# Altium schematic sheet control3_MCU.SchDoc
size A3; SheetNumber: 1; SheetTotal: 1
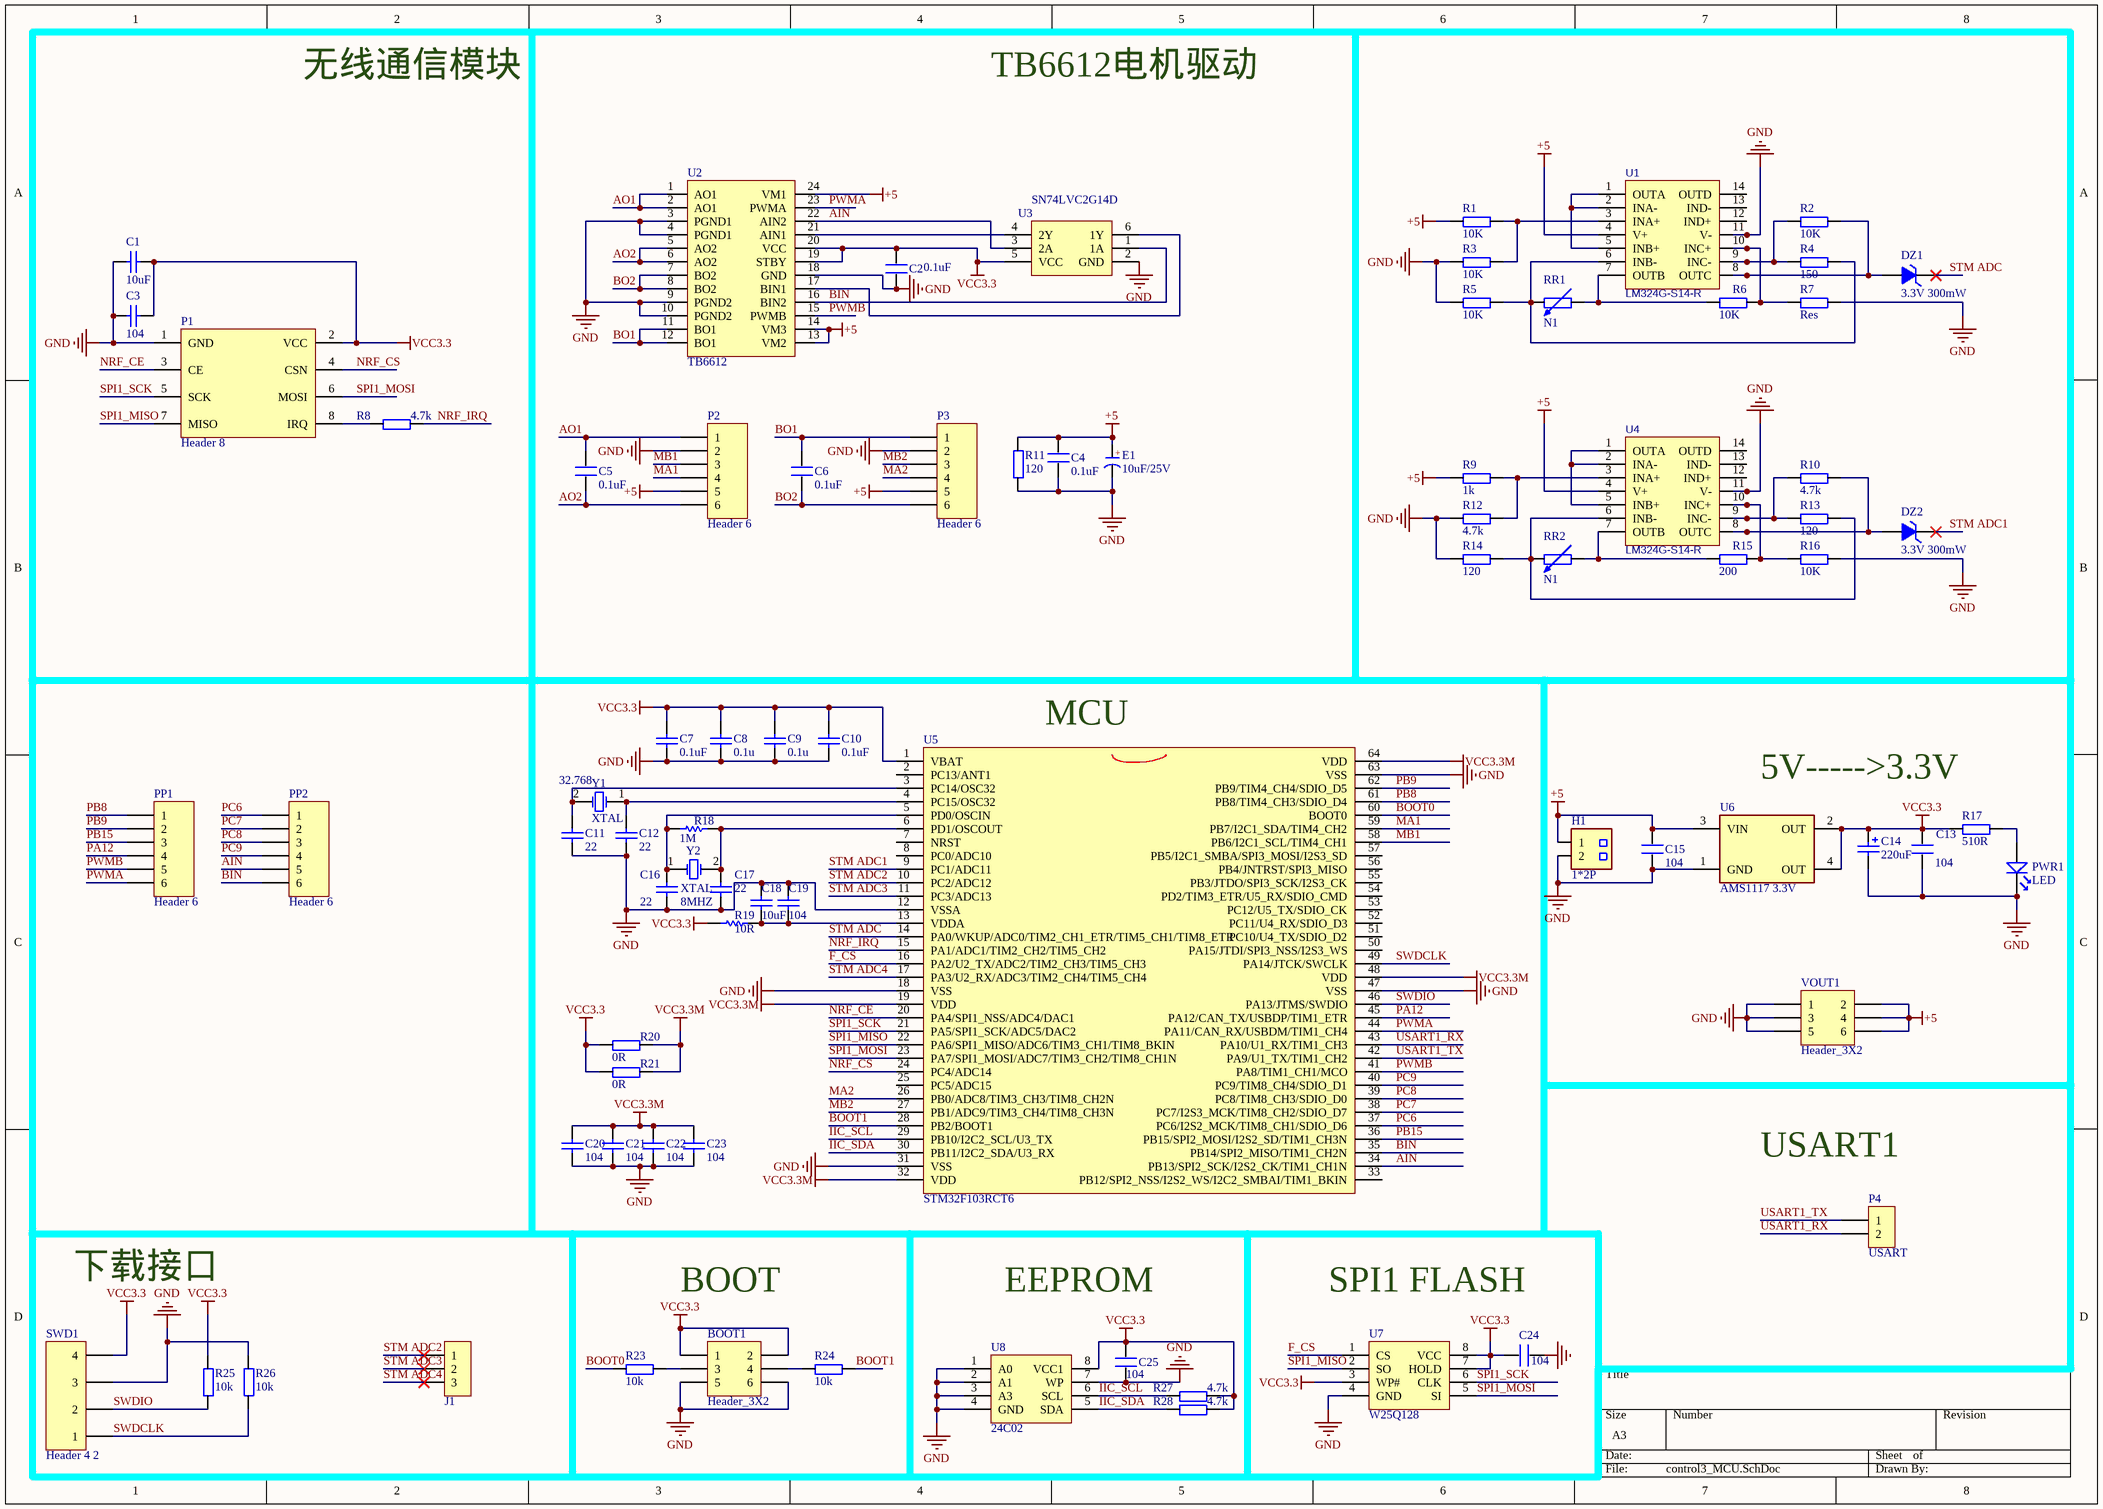
[diagram p0: control3_MCU.SchDoc]

## Parts
BOOT1  Header_3X2  [H2.54-2X3]
C1  Cap  [CAP[0603]]  (value not drawn)
C2  0.1uF  [CAP[0603]]
C3  Cap  [CAP[0603]]  (value not drawn)
C4  0.1uF  [CAP[0603]]
C5  0.1uF  [CAP[0603]]
C6  0.1uF  [CAP[0603]]
C7  0.1uF  [CAP[0603]]
C8  104  [CAP[0603]]  (value not drawn)
C9  104  [CAP[0603]]  (value not drawn)
C10  0.1uF  [CAP[0603]]
C11  Cap  [CAP[0603]]  (value not drawn)
C12  Cap  [CAP[0603]]  (value not drawn)
C13  104  [CAP[0805]]
C14  220uF  [CAP-D8SMD]
C15  104  [CAP[0805]]
C16  Cap  [CAP[0805]]  (value not drawn)
C17  Cap  [CAP[0805]]  (value not drawn)
C18  Cap  [CAP[0805]]  (value not drawn)
C19  Cap  [CAP[0805]]  (value not drawn)
C20  Cap  [CAP[0603]]  (value not drawn)
C21  Cap  [CAP[0603]]  (value not drawn)
C22  Cap  [CAP[0603]]  (value not drawn)
C23  Cap  [CAP[0603]]  (value not drawn)
C24  104  [CAP[0603]]
C25  104  [CAP[0603]]
DZ1  3.3V 300mW  [SOD-123_L2.8-W1.8-LS3.7-RD]
DZ2  3.3V 300mW  [SOD-123_L2.8-W1.8-LS3.7-RD]
E1  10uF/25V  [CAP-SMD_L3.5-W2.8-R-RD]
H1  1*2P  [CONN-TH_P2.54_KF128-2.54-2P]
J1  HDR-1X3  [H2.54-1X3]  (value not drawn)
P1  Header 8  [HDR2.54-LI-2x4P]
P2  Header 6  [CONN-TH_6P-P2.54_KF128-2.54-6P]
P3  Header 6  [CONN-TH_6P-P2.54_KF128-2.54-6P]
P4  USART  [H2.54-1X2]
PP1  Header 6  [HDR2.54-LI-6P]
PP2  Header 6  [HDR2.54-LI-6P]
PWR1  LED  [LED[0805]]
R1  10K  [0603_R_JX]
R2  10K  [0603_R_JX]
R3  10K  [0603_R_JX]
R4  150  [0603_R_JX]
R5  10K  [0603_R_JX]
R6  10K  [0603_R_JX]
R7  Res  [RES[0603]]
R8  4.7k  [RES[0603]]
R9  1k  [0603_R_JX]
R10  4.7k  [RES[0603]]
R11  120  [RES[0603]]
R12  4.7k  [RES[0603]]
R13  120  [RES[0603]]
R14  120  [RES[0603]]
R15  200  [0603_R_JX]
R16  10K  [0603_R_JX]
R17  510R  [RES[0603]]
R18  Res  [RES[0603]]  (value not drawn)
R19  Res  [RES[0603]]  (value not drawn)
R20  0R  [RES[0603]]
R21  0R  [RES[0603]]
R23  10k  [RES[0603]]
R24  10k  [RES[0603]]
R25  10k  [RES[0603]]
R26  10k  [RES[0603]]
R27  4.7k  [RES[0603]]
R28  4.7k  [RES[0603]]
RR1  N1  [CONN-TH_P2.54_KF128-2.54-2P]
RR2  N1  [CONN-TH_P2.54_KF128-2.54-2P]
SWD1  Header 4 2  [H2.54-1X4]
U1  LM324G-S14-R  [LM324]
U2  TB6612  [SSOP24_L]
U3  SN74LVC2G14D  [SOT23-6L]
U4  LM324G-S14-R  [LM324]
U5  STM32F103RCT6  [LQFP-64]
U6  AMS1117 3.3V  [SOT-223(AMS1117-3.3)]
U7  W25Q128  [SOP-8_width]
U8  24C02  [SO-8]
VOUT1  Header_3X2  [H2.54-2X3]
Y1  XTAL  [XTAL-32768_2]
Y2  XTAL  [XTAL]

## Nets
+5: C4.2 C15.2 E1.1(A) H1.1 P2.5 P3.5 R1.1 R9.1 R11.2 U1.4(V+) U2.13(VM2) U2.14(VM3) U2.24(VM1) U4.4(V+) U6.3(VIN) VOUT1.2 VOUT1.4 VOUT1.6
GND: BOOT1.5 BOOT1.6 C1.2 C2.1 C3.2 C4.1 C7.1 C8.1 C9.1 C10.1 C11.1 C12.1 C13.1 C14.2 C15.1 C16.1 C17.1 C18.2 C19.2 C20.2 C21.2 C22.2 C23.2 C24.1 C25.1 E1.2(K) H1.2 P1.1(GND) P2.2 P3.2 PWR1.2 R3.1 R5.1 R7.2 R11.1 R12.1 R14.1 R16.1 R26.2 SWD1.3 U1.11(V-) U2.3(PGND1) U2.4(PGND1) U2.9(PGND2) U2.10(PGND2) U2.18(GND) U3.2(GND) U4.11(V-) U5.12(VSSA) U5.18(VSS) U5.31(VSS) U5.47(VSS) U5.63(VSS) U6.1(GND) U7.4(GND) U8.1(A0) U8.2(A1) U8.3(A3) U8.4(GND) U8.7(WP) VOUT1.1 VOUT1.3 VOUT1.5
VCC3.3: BOOT1.1 BOOT1.2 C1.1 C2.2 C3.1 C7.2 C8.2 C9.2 C10.2 C13.2 C14.1 C24.2 C25.2 P1.2(VCC) R17.1 R19.2 R20.1 R21.1 R25.2 R27.2 R28.2 SWD1.4 U2.19(STBY) U2.20(VCC) U3.5(VCC) U5.1(VBAT) U6.2(OUT) U6.4(OUT) U7.3(WP#) U7.7(HOLD) U7.8(VCC) U8.8(VCC1)
VCC3.3M: C20.1 C21.1 C22.1 C23.1 R20.2 R21.2 U5.19(VDD) U5.32(VDD) U5.48(VDD) U5.64(VDD)
AIN: PP2.5 U2.22(AIN2) U3.3(2A) U5.34(PB13/SPI2_SCK/I2S2_CK/TIM1_CH1N)
AO1: C5.2 P2.1 U2.1(AO1) U2.2(AO1)
AO2: C5.1 P2.6 U2.5(AO2) U2.6(AO2)
BIN: PP2.6 U2.16(BIN2) U3.1(1A) U5.35(PB14/SPI2_MISO/TIM1_CH2N)
BO1: C6.2 P3.1 U2.11(BO1) U2.12(BO1)
BO2: C6.1 P3.6 U2.7(BO2) U2.8(BO2)
BOOT0: R23.1 U5.60(BOOT0)
BOOT1: R24.2 U5.28(PB2/BOOT1)
F_CS: U5.16(PA2/U2_TX/ADC2/TIM2_CH3/TIM5_CH3) U7.1(CS)
IIC_SCL: R27.1 U5.29(PB10/I2C2_SCL/U3_TX) U8.6(SCL)
IIC_SDA: R28.1 U5.30(PB11/I2C2_SDA/U3_RX) U8.5(SDA)
MA1: P2.4 U5.59(PB7/I2C1_SDA/TIM4_CH2)
MA2: P3.4 U5.26(PB0/ADC8/TIM3_CH3/TIM8_CH2N)
MB1: P2.3 U5.58(PB6/I2C1_SCL/TIM4_CH1)
MB2: P3.3 U5.27(PB1/ADC9/TIM3_CH4/TIM8_CH3N)
NRF_CE: P1.3(CE) U5.20(PA4/SPI1_NSS/ADC4/DAC1)
NRF_CS: P1.4(CSN) U5.24(PC4/ADC14)
NRF_IRQ: R8.2 U5.15(PA1/ADC1/TIM2_CH2/TIM5_CH2)
PA12: PP1.4 U5.45(PA12/CAN_TX/USBDP/TIM1_ETR)
PB8: PP1.1 U5.61(PB8/TIM4_CH3/SDIO_D4)
PB9: PP1.2 U5.62(PB9/TIM4_CH4/SDIO_D5)
PB15: PP1.3 U5.36(PB15/SPI2_MOSI/I2S2_SD/TIM1_CH3N)
PC6: PP2.1 U5.37(PC6/I2S2_MCK/TIM8_CH1/SDIO_D6)
PC7: PP2.2 U5.38(PC7/I2S3_MCK/TIM8_CH2/SDIO_D7)
PC8: PP2.3 U5.39(PC8/TIM8_CH3/SDIO_D0)
PC9: PP2.4 U5.40(PC9/TIM8_CH4/SDIO_D1)
PWMA: PP1.6 U2.23(PWMA) U5.44(PA11/CAN_RX/USBDM/TIM1_CH4)
PWMB: PP1.5 U2.15(PWMB) U5.41(PA8/TIM1_CH1/MCO)
SPI1_MISO: P1.7(MISO) U5.22(PA6/SPI1_MISO/ADC6/TIM3_CH1/TIM8_BKIN) U7.2(SO)
SPI1_MOSI: P1.6(MOSI) U5.23(PA7/SPI1_MOSI/ADC7/TIM3_CH2/TIM8_CH1N) U7.5(SI)
SPI1_SCK: P1.5(SCK) U5.21(PA5/SPI1_SCK/ADC5/DAC2) U7.6(CLK)
STM ADC: DZ1.2(K) U5.14(PA0/WKUP/ADC0/TIM2_CH1_ETR/TIM5_CH1/TIM8_ETR)
STM ADC1: DZ2.2(K) U5.9(PC1/ADC11)
STM ADC2: J1.1 U5.10(PC2/ADC12)
STM ADC3: J1.2 U5.11(PC3/ADC13)
STM ADC4: J1.3 U5.17(PA3/U2_RX/ADC3/TIM2_CH4/TIM5_CH4)
SWDCLK: R26.1 SWD1.1 U5.49(PA14/JTCK/SWCLK)
SWDIO: R25.1 SWD1.2 U5.46(PA13/JTMS/SWDIO)
USART1_RX: P4.2 U5.43(PA10/U1_RX/TIM1_CH3)
USART1_TX: P4.1 U5.42(PA9/U1_TX/TIM1_CH2)
NetBOOT1_3: BOOT1.3 R23.2
NetBOOT1_4: BOOT1.4 R24.1
NetC11_2: C11.2 U5.3(PC14/OSC32) Y1.2(OSC2)
NetC12_2: C12.2 U5.4(PC15/OSC32) Y1.1(OSC1)
NetC16_2: C16.2 R18.2 U5.5(PD0/OSCIN) Y2.1(OSC1)
NetC17_2: C17.2 R18.1 U5.6(PD1/OSCOUT) Y2.2(OSC2)
NetC18_1: C18.1 C19.1 R19.1 U5.13(VDDA)
NetDZ1_1: DZ1.1(A) R2.2 U1.8(OUTC)
NetDZ2_1: DZ2.1(A) R10.2 U4.8(OUTC)
NetP1_8: P1.8(IRQ) R8.1
NetPWR1_1: PWR1.1 R17.2
NetR1_2: R1.2 R3.2 U1.3(INA+)
NetR2_1: R2.1 R4.1 U1.9(INC-)
NetR4_2: R4.2 R5.2 RR1.1 U1.6(INB-)
NetR6_1: R6.1 RR1.2 U1.7(OUTB)
NetR6_2: R6.2 R7.1 U1.10(INC+)
NetR9_2: R9.2 R12.2 U4.3(INA+)
NetR10_1: R10.1 R13.1 U4.9(INC-)
NetR13_2: R13.2 R14.2 RR2.1 U4.6(INB-)
NetR15_1: R15.1 RR2.2 U4.7(OUTB)
NetR15_2: R15.2 R16.2 U4.10(INC+)
NetU1_1: U1.1(OUTA) U1.2(INA-) U1.5(INB+)
NetU2_17: U2.17(BIN1) U3.6(1Y)
NetU2_21: U2.21(AIN1) U3.4(2Y)
NetU4_1: U4.1(OUTA) U4.2(INA-) U4.5(INB+)

Not connected (* = marked no-connect by the designer): U1 12(IND+) 13(IND-) 14(OUTD); U4 12(IND+) 13(IND-) 14(OUTD); U5 2(PC13/ANT1) 7(NRST) 8(PC0/ADC10) 25(PC5/ADC15) 33(PB12/SPI2_NSS/I2S2_WS/I2C2_SMBAI/TIM1_BKIN) 50(PA15/JTDI/SPI3_NSS/I2S3_WS) 51(PC10/U4_TX/SDIO_D2) 52(PC11/U4_RX/SDIO_D3) 53(PC12/U5_TX/SDIO_CK) 54(PD2/TIM3_ETR/U5_RX/SDIO_CMD) 55(PB3/JTDO/SPI3_SCK/I2S3_CK) 56(PB4/JNTRST/SPI3_MISO) 57(PB5/I2C1_SMBA/SPI3_MOSI/I2S3_SD)

## Notes on the sheet
- 无线通信模块
- TB6612电机驱动
- (near U5) MCU
- 5V----->3.3V
- USART1
- 下载接口
- BOOT
- EEPROM
- SPI1 FLASH
- (in symbol C-CAP) +
- (in symbol Cap) 104; 0.1u
- (in symbol Res) 1M; 10R
- (in symbol XTAL) 32.768; 8MHZ

## Library data of the parts
BOOT1 VOUT1 = Header_3X2: Header, 3-Pin, Dual row
C1 C18 = Cap: 10uF
C2 C4-C6 C13 C15 C24 C25 = C 0603_L
C3 = Cap: 104
C7 C10 = Cap
C8 C9 = Cap: 0.1uF
C11 C12 C16 C17 = Cap: 22
C14 = CAP+
DZ1 DZ2 = 1N4619: 3V/0.5W稳压管; 版权归属: 源创客; BOM名称: 3V/0.5W稳压管; 学习资源: www.ooocke.com
E1 = C-CAP: 直插电解电容; 版权归属: 源创客; BOM名称: 直插电解电容; 学习资源: www.ooocke.com
H1 = HDR1*2
J1 = Header 3: 3P接插件; 版权归属: 源创客; BOM名称: 3P接插件; 学习资源: www.ooocke.com
P1 = Header 8: ADC&DAC
P2 P3 PP1 PP2 = Header 6: motor_Header
P4 = Header 2x2
R1-R7 R9-R16 = R
R8 R17 R20 R21 R23-R28 = R 0603_L: 电阻
RR1 RR2 = N1: 可变电阻
SWD1 = Header 4 2: Header 4
U1 U4 = LM324G-S14-R: BOM_Manufacturer: UTC; SMT Type: Extend; BOM_Supplier: LCSC; BOM_Manufacturer Part: LM324G-S14-R; image: //image.lceda.cn/szlcsc/C71099.jpg; BOM_Supplier Part: C71099; BOM_LCSC Assembly: Yes; spicePre: U; spiceSymbolName: LM324G-S14-R
U3 = Header_3X2_1: Header, 3-Pin, Dual row
U6 = AMS1117
U8 = 24C02: EEPROM